# Altium schematic sheet Diode Drivers.SchDoc
size A3
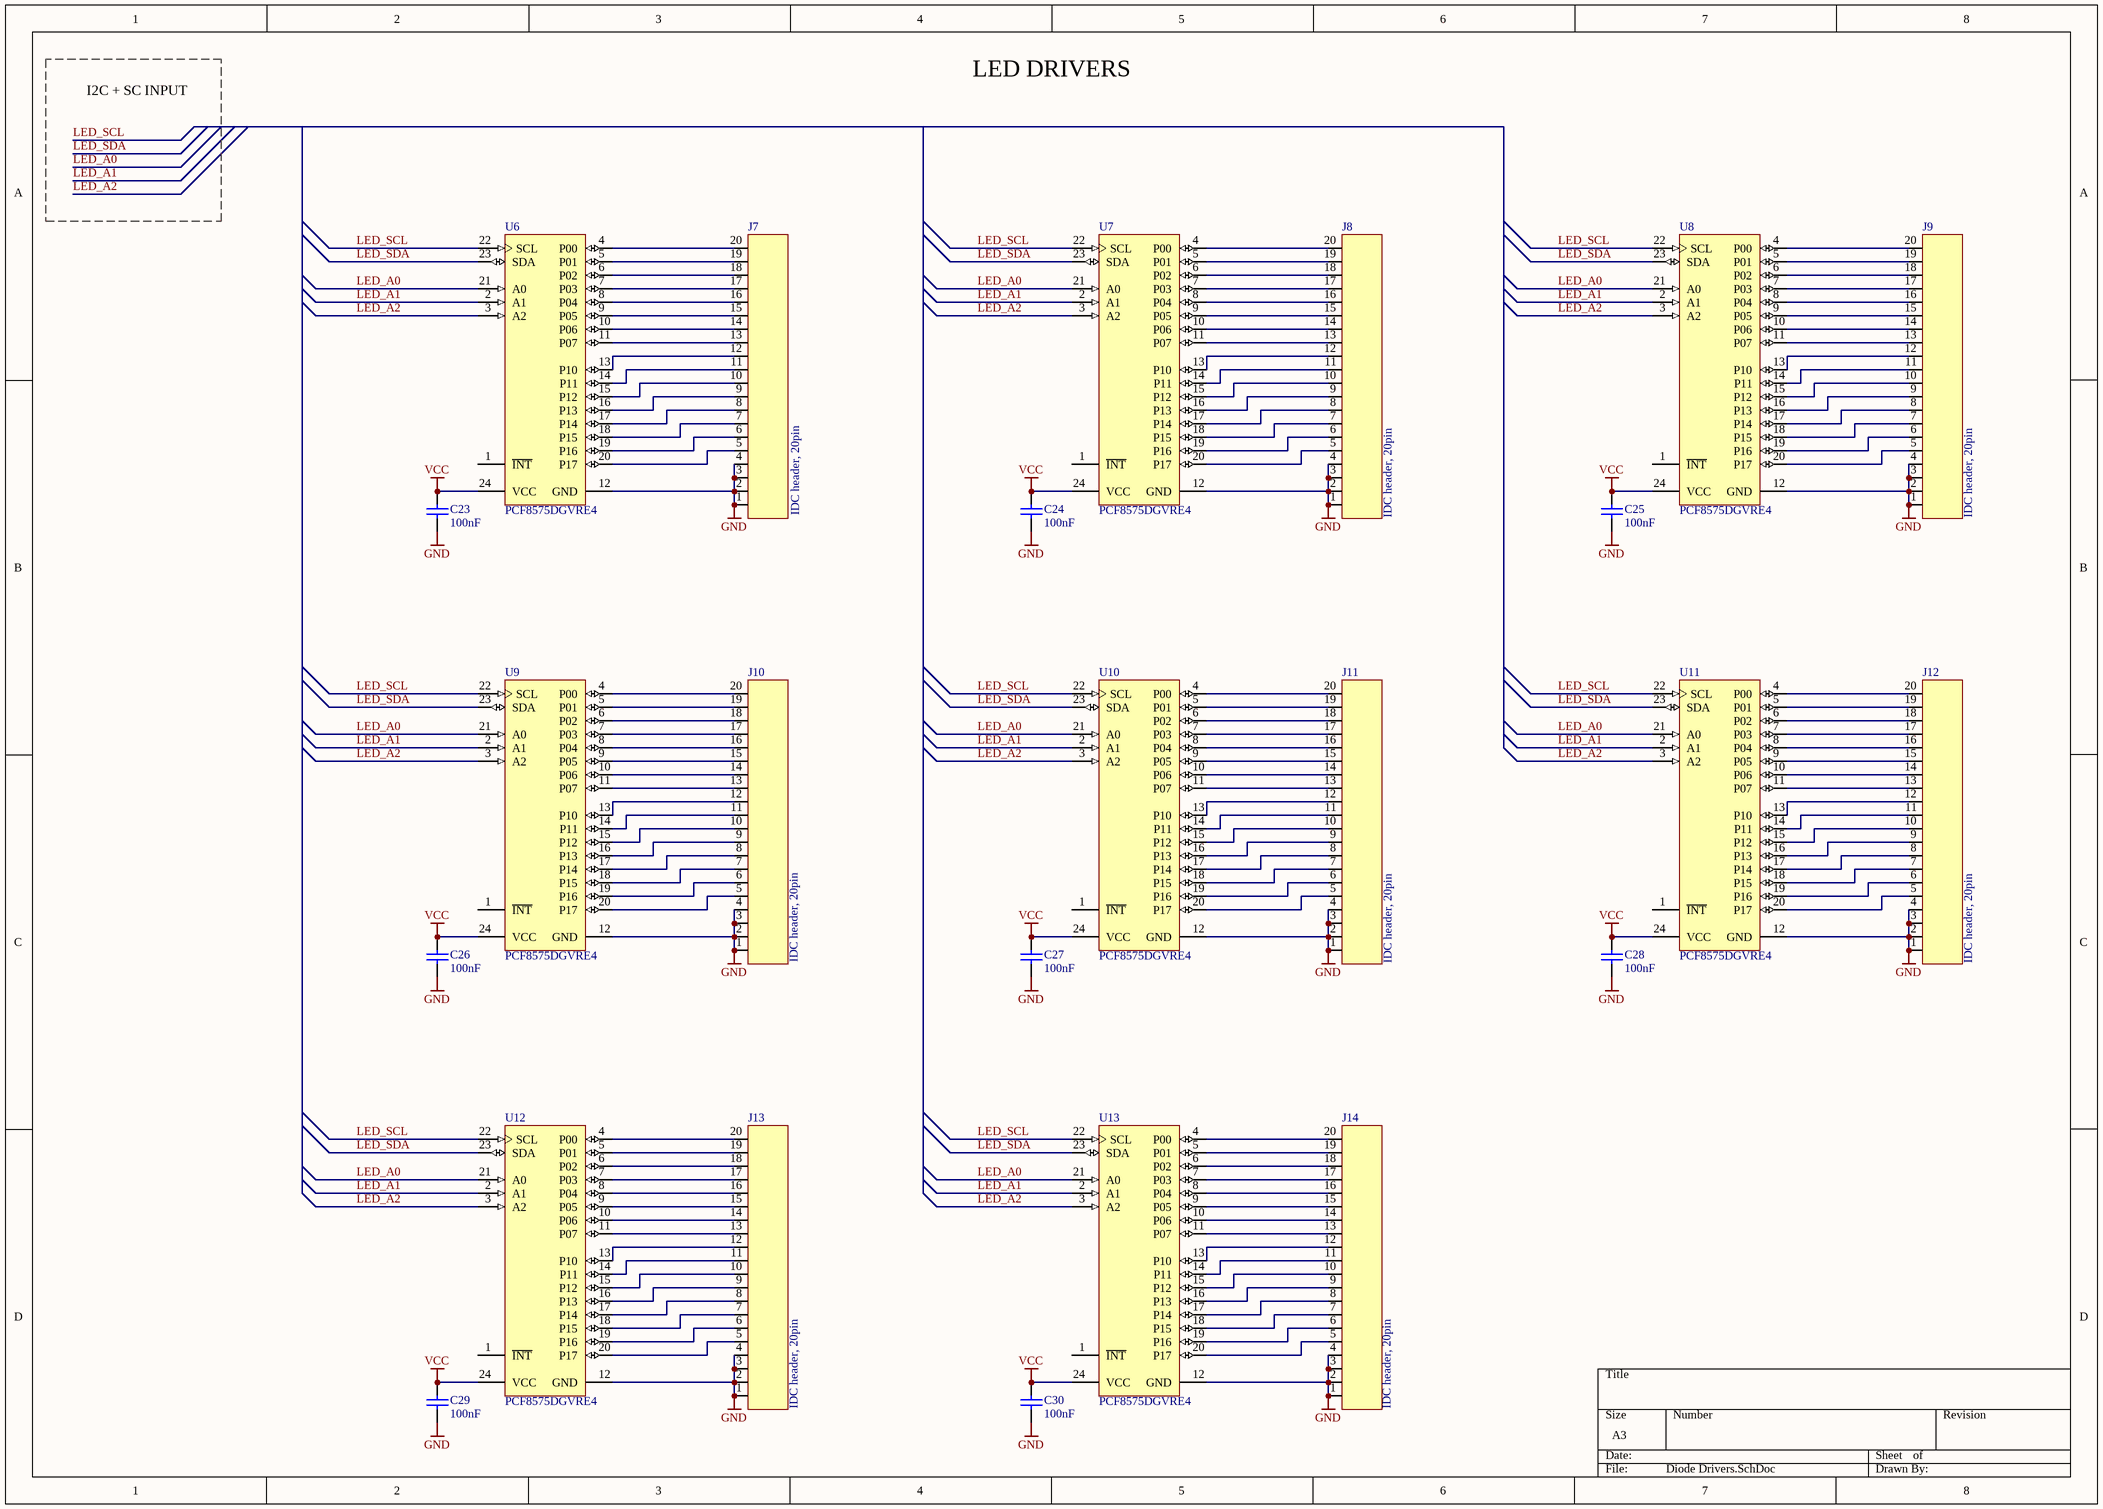
[diagram p0: Diode Drivers.SchDoc]

## Parts
C23  value 100nF  [CAPC0603(1608)100_N]  (hidden comment: CAP 100nF 25V 0603(1608))
C24  value 100nF  [CAPC0603(1608)100_N]  (hidden comment: CAP 100nF 25V 0603(1608))
C25  value 100nF  [CAPC0603(1608)100_N]  (hidden comment: CAP 100nF 25V 0603(1608))
C26  value 100nF  [CAPC0603(1608)100_N]  (hidden comment: CAP 100nF 25V 0603(1608))
C27  value 100nF  [CAPC0603(1608)100_N]  (hidden comment: CAP 100nF 25V 0603(1608))
C28  value 100nF  [CAPC0603(1608)100_N]  (hidden comment: CAP 100nF 25V 0603(1608))
C29  value 100nF  [CAPC0603(1608)100_N]  (hidden comment: CAP 100nF 25V 0603(1608))
C30  value 100nF  [CAPC0603(1608)100_N]  (hidden comment: CAP 100nF 25V 0603(1608))
J7  IDC header, 20pin  [PKG_ZL231-20PG_R2.54-V]
J8  IDC header, 20pin  [PKG_ZL231-20PG_R2.54-V]
J9  IDC header, 20pin  [PKG_ZL231-20PG_R2.54-V]
J10  IDC header, 20pin  [PKG_ZL231-20PG_R2.54-V]
J11  IDC header, 20pin  [PKG_ZL231-20PG_R2.54-V]
J12  IDC header, 20pin  [PKG_ZL231-20PG_R2.54-V]
J13  IDC header, 20pin  [PKG_ZL231-20PG_R2.54-V]
J14  IDC header, 20pin  [PKG_ZL231-20PG_R2.54-V]
U6  PCF8575DGVRE4  [DGV24_M]
U7  PCF8575DGVRE4  [DGV24_M]
U8  PCF8575DGVRE4  [DGV24_M]
U9  PCF8575DGVRE4  [DGV24_M]
U10  PCF8575DGVRE4  [DGV24_M]
U11  PCF8575DGVRE4  [DGV24_M]
U12  PCF8575DGVRE4  [DGV24_M]
U13  PCF8575DGVRE4  [DGV24_M]

## Nets
GND: C23.2 C24.2 C25.2 C26.2 C27.2 C28.2 C29.2 C30.2 J7.1 J7.2 J7.3 J7.4 J8.1 J8.2 J8.3 J8.4 J9.1 J9.2 J9.3 J9.4 J10.1 J10.2 J10.3 J10.4 J11.1 J11.2 J11.3 J11.4 J12.1 J12.2 J12.3 J12.4 J13.1 J13.2 J13.3 J13.4 J14.1 J14.2 J14.3 J14.4 U6.12(GND) U7.12(GND) U8.12(GND) U9.12(GND) U10.12(GND) U11.12(GND) U12.12(GND) U13.12(GND)
VCC: C23.1 C24.1 C25.1 C26.1 C27.1 C28.1 C29.1 C30.1 U6.24(VCC) U7.24(VCC) U8.24(VCC) U9.24(VCC) U10.24(VCC) U11.24(VCC) U12.24(VCC) U13.24(VCC)
LED_A0: U6.21(A0) U7.21(A0) U8.21(A0) U9.21(A0) U10.21(A0) U11.21(A0) U12.21(A0) U13.21(A0)
LED_A1: U6.2(A1) U7.2(A1) U8.2(A1) U9.2(A1) U10.2(A1) U11.2(A1) U12.2(A1) U13.2(A1)
LED_A2: U6.3(A2) U7.3(A2) U8.3(A2) U9.3(A2) U10.3(A2) U11.3(A2) U12.3(A2) U13.3(A2)
LED_SCL: U6.22(SCL) U7.22(SCL) U8.22(SCL) U9.22(SCL) U10.22(SCL) U11.22(SCL) U12.22(SCL) U13.22(SCL)
LED_SDA: U6.23(SDA) U7.23(SDA) U8.23(SDA) U9.23(SDA) U10.23(SDA) U11.23(SDA) U12.23(SDA) U13.23(SDA)
NetJ7_5: J7.5 U6.20(P17)
NetJ7_6: J7.6 U6.19(P16)
NetJ7_7: J7.7 U6.18(P15)
NetJ7_8: J7.8 U6.17(P14)
NetJ7_9: J7.9 U6.16(P13)
NetJ7_10: J7.10 U6.15(P12)
NetJ7_11: J7.11 U6.14(P11)
NetJ7_12: J7.12 U6.13(P10)
NetJ7_13: J7.13 U6.11(P07)
NetJ7_14: J7.14 U6.10(P06)
NetJ7_15: J7.15 U6.9(P05)
NetJ7_16: J7.16 U6.8(P04)
NetJ7_17: J7.17 U6.7(P03)
NetJ7_18: J7.18 U6.6(P02)
NetJ7_19: J7.19 U6.5(P01)
NetJ7_20: J7.20 U6.4(P00)
NetJ8_5: J8.5 U7.20(P17)
NetJ8_6: J8.6 U7.19(P16)
NetJ8_7: J8.7 U7.18(P15)
NetJ8_8: J8.8 U7.17(P14)
NetJ8_9: J8.9 U7.16(P13)
NetJ8_10: J8.10 U7.15(P12)
NetJ8_11: J8.11 U7.14(P11)
NetJ8_12: J8.12 U7.13(P10)
NetJ8_13: J8.13 U7.11(P07)
NetJ8_14: J8.14 U7.10(P06)
NetJ8_15: J8.15 U7.9(P05)
NetJ8_16: J8.16 U7.8(P04)
NetJ8_17: J8.17 U7.7(P03)
NetJ8_18: J8.18 U7.6(P02)
NetJ8_19: J8.19 U7.5(P01)
NetJ8_20: J8.20 U7.4(P00)
NetJ9_5: J9.5 U8.20(P17)
NetJ9_6: J9.6 U8.19(P16)
NetJ9_7: J9.7 U8.18(P15)
NetJ9_8: J9.8 U8.17(P14)
NetJ9_9: J9.9 U8.16(P13)
NetJ9_10: J9.10 U8.15(P12)
NetJ9_11: J9.11 U8.14(P11)
NetJ9_12: J9.12 U8.13(P10)
NetJ9_13: J9.13 U8.11(P07)
NetJ9_14: J9.14 U8.10(P06)
NetJ9_15: J9.15 U8.9(P05)
NetJ9_16: J9.16 U8.8(P04)
NetJ9_17: J9.17 U8.7(P03)
NetJ9_18: J9.18 U8.6(P02)
NetJ9_19: J9.19 U8.5(P01)
NetJ9_20: J9.20 U8.4(P00)
NetJ10_5: J10.5 U9.20(P17)
NetJ10_6: J10.6 U9.19(P16)
NetJ10_7: J10.7 U9.18(P15)
NetJ10_8: J10.8 U9.17(P14)
NetJ10_9: J10.9 U9.16(P13)
NetJ10_10: J10.10 U9.15(P12)
NetJ10_11: J10.11 U9.14(P11)
NetJ10_12: J10.12 U9.13(P10)
NetJ10_13: J10.13 U9.11(P07)
NetJ10_14: J10.14 U9.10(P06)
NetJ10_15: J10.15 U9.9(P05)
NetJ10_16: J10.16 U9.8(P04)
NetJ10_17: J10.17 U9.7(P03)
NetJ10_18: J10.18 U9.6(P02)
NetJ10_19: J10.19 U9.5(P01)
NetJ10_20: J10.20 U9.4(P00)
NetJ11_5: J11.5 U10.20(P17)
NetJ11_6: J11.6 U10.19(P16)
NetJ11_7: J11.7 U10.18(P15)
NetJ11_8: J11.8 U10.17(P14)
NetJ11_9: J11.9 U10.16(P13)
NetJ11_10: J11.10 U10.15(P12)
NetJ11_11: J11.11 U10.14(P11)
NetJ11_12: J11.12 U10.13(P10)
NetJ11_13: J11.13 U10.11(P07)
NetJ11_14: J11.14 U10.10(P06)
NetJ11_15: J11.15 U10.9(P05)
NetJ11_16: J11.16 U10.8(P04)
NetJ11_17: J11.17 U10.7(P03)
NetJ11_18: J11.18 U10.6(P02)
NetJ11_19: J11.19 U10.5(P01)
NetJ11_20: J11.20 U10.4(P00)
NetJ12_5: J12.5 U11.20(P17)
NetJ12_6: J12.6 U11.19(P16)
NetJ12_7: J12.7 U11.18(P15)
NetJ12_8: J12.8 U11.17(P14)
NetJ12_9: J12.9 U11.16(P13)
NetJ12_10: J12.10 U11.15(P12)
NetJ12_11: J12.11 U11.14(P11)
NetJ12_12: J12.12 U11.13(P10)
NetJ12_13: J12.13 U11.11(P07)
NetJ12_14: J12.14 U11.10(P06)
NetJ12_15: J12.15 U11.9(P05)
NetJ12_16: J12.16 U11.8(P04)
NetJ12_17: J12.17 U11.7(P03)
NetJ12_18: J12.18 U11.6(P02)
NetJ12_19: J12.19 U11.5(P01)
NetJ12_20: J12.20 U11.4(P00)
NetJ13_5: J13.5 U12.20(P17)
NetJ13_6: J13.6 U12.19(P16)
NetJ13_7: J13.7 U12.18(P15)
NetJ13_8: J13.8 U12.17(P14)
NetJ13_9: J13.9 U12.16(P13)
NetJ13_10: J13.10 U12.15(P12)
NetJ13_11: J13.11 U12.14(P11)
NetJ13_12: J13.12 U12.13(P10)
NetJ13_13: J13.13 U12.11(P07)
NetJ13_14: J13.14 U12.10(P06)
NetJ13_15: J13.15 U12.9(P05)
NetJ13_16: J13.16 U12.8(P04)
NetJ13_17: J13.17 U12.7(P03)
NetJ13_18: J13.18 U12.6(P02)
NetJ13_19: J13.19 U12.5(P01)
NetJ13_20: J13.20 U12.4(P00)
NetJ14_5: J14.5 U13.20(P17)
NetJ14_6: J14.6 U13.19(P16)
NetJ14_7: J14.7 U13.18(P15)
NetJ14_8: J14.8 U13.17(P14)
NetJ14_9: J14.9 U13.16(P13)
NetJ14_10: J14.10 U13.15(P12)
NetJ14_11: J14.11 U13.14(P11)
NetJ14_12: J14.12 U13.13(P10)
NetJ14_13: J14.13 U13.11(P07)
NetJ14_14: J14.14 U13.10(P06)
NetJ14_15: J14.15 U13.9(P05)
NetJ14_16: J14.16 U13.8(P04)
NetJ14_17: J14.17 U13.7(P03)
NetJ14_18: J14.18 U13.6(P02)
NetJ14_19: J14.19 U13.5(P01)
NetJ14_20: J14.20 U13.4(P00)

Not connected (* = marked no-connect by the designer): U6 1(~{INT}); U7 1(~{INT}); U8 1(~{INT}); U9 1(~{INT}); U10 1(~{INT}); U11 1(~{INT}); U12 1(~{INT}); U13 1(~{INT})

## Notes on the sheet
- I2C + SC INPUT
- LED DRIVERS

## Library data of the parts
C23-C30 = CMP-1035-02589-1: CAP 100nF 25V ±20% 0603 (1608 Metric) Thickness 1mm SMD; Case-EIA: 0603; Tolerance: Â±20%; Case-Metric: 1608; Max Thickness: 1 mm; Technology: SMT; Rated Voltage: 25 V
J7 J8 J10-J14 = J_ZL231-20PG_1: Złącze IDC, męskie, proste, 20 pinów, na PCB
J9 = J_ZL231-20PG_1
U6-U13 = CMP-0314-00413-1: Remote 16-Bit I2C and SMBus I/O Expander with Interrupt Output, 2.5 to 5.5 V, -40 to 85 degC, 24-pin TVSOP (DGV), Green (RoHS & no Sb/Br); Manufacturer: Texas Instruments; Max Frequency(kHz): 400; VCC(Max)(V): 5.5; SubFamily: I2C IO Expander; Push-Pull I/O Type: Yes; I2C Address: 0100 xxx; fSCLK(Max)(MHz): 0.4; VCC(Min)(V): 2.5; # of I/Os: 16; Voltage Nodes(V): 5.5, 3.6, 2.7, 2.5; Eco-Plan: Green (RoHS & no Sb/Br); ComponentLink2URL: http://www.ti.com/litv/pdf/mpds211a; DatasheetVersion: SCPS121D; PackageDescription: 24-Pin Thin Shrink Small Outline Package 0.4 mm Pitch; Reset Input: No; PackageVersion: revE, Aug-2000; ComponentLink2Description: Package Specification; PackageReference: DGV24; PartNumber: PCF8575DGVRE4; ComponentLink1Description: Datasheet; Interrupt Output: Yes; Mounting Technology: Surface Mount; ComponentLink1URL: http://www.ti.com/general/docs/lit/getliterature.tsp?genericPartNumber=PCF8575&fileType=pdf; Vcc range(V): 2.5 to 5.5